# Altium schematic sheet Sheet1.SchDoc
size A4
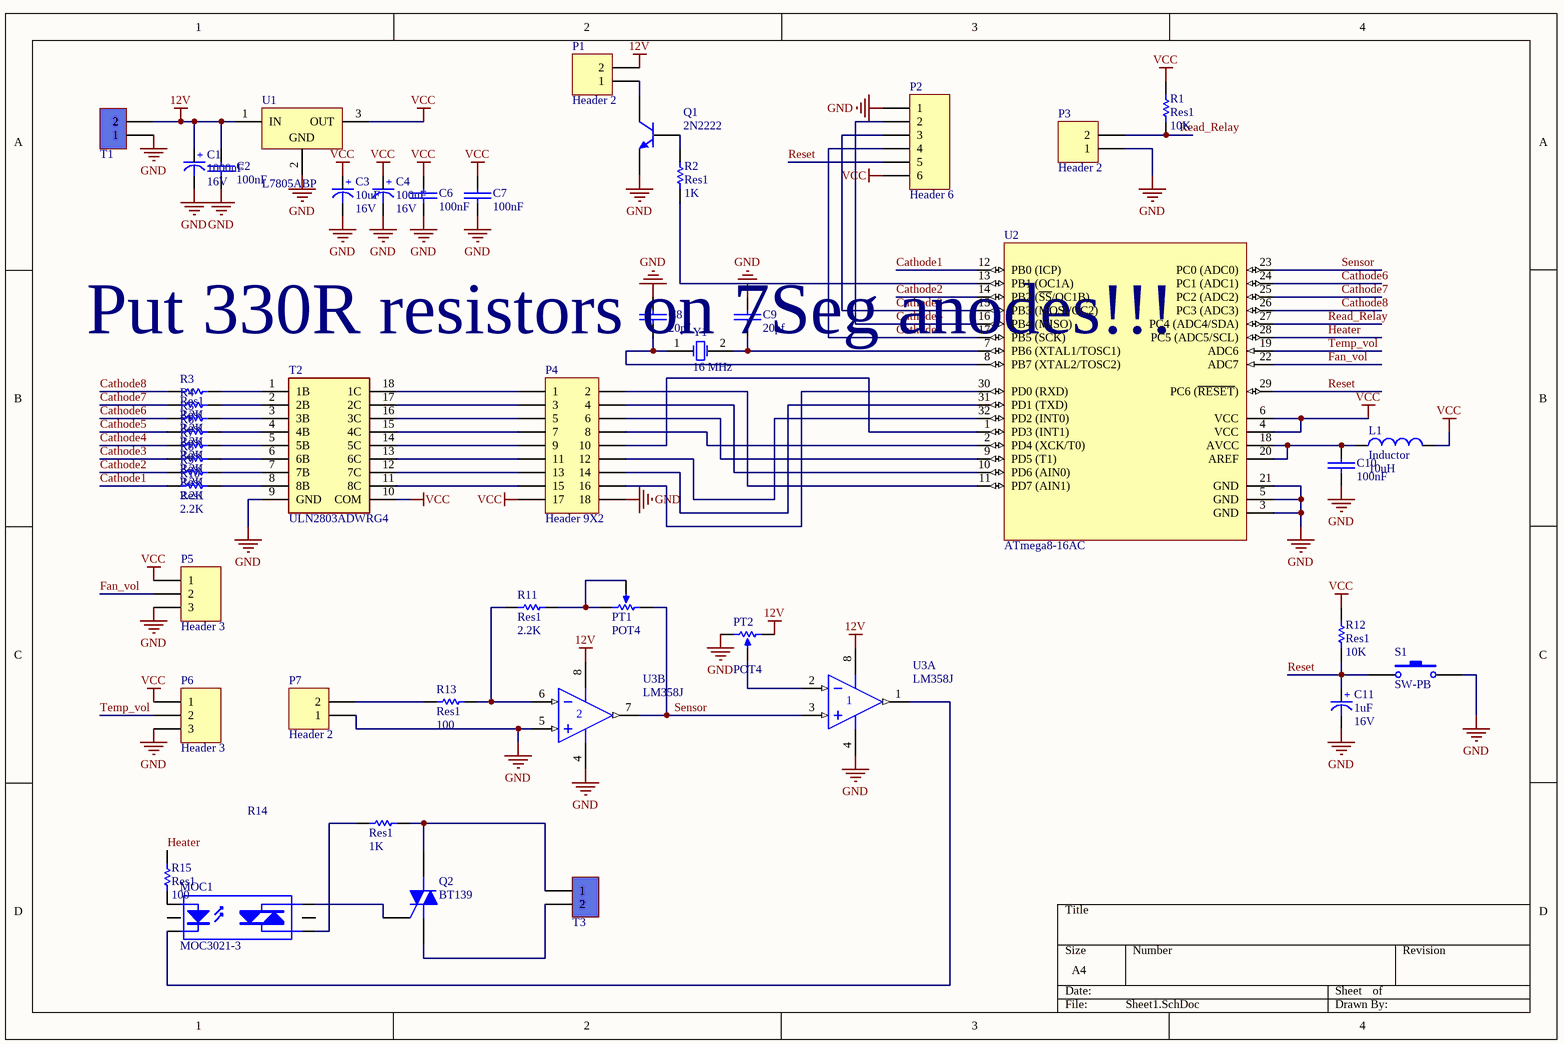
[diagram p0: Sheet1.SchDoc]

## Parts
C1  Voltage: 16V  [cap 04]  (hidden comment: 1000uF)
C2  100nF  [Cap - 100nF]
C3  Voltage: 16V  [cap 02]  (hidden comment: 10uF)
C4  Voltage: 16V  [cap 03]  (hidden comment: 100uF)
C6  100nF  [CAP 1206 (3216X15L)]
C7  100nF  [CAP 1206 (3216X15L)]
C8  20pf  [CAP 1206 (3216X15L)]
C9  20pf  [CAP 1206 (3216X15L)]
C10  100nF  [CAP 1206 (3216X15L)]
C11  Voltage: 16V  [cap 00]  (hidden comment: 1uF)
L1  Inductor  value 10uH  [AXIAL-0.4]
MOC1  MOC3021-3  [DIP-6]
P1  Header 2  [HDR1X2]
P2  Header 6  [HDR1X6]
P3  Header 2  [HDR1X2]
P4  Header 9X2  [HDR2X9]
P5  Header 3  [HDR1X3]
P6  Header 3  [HDR1X3]
P7  Header 2  [HDR1X2]
PT1  POT4  [POT4]
PT2  POT4  [POT4]
Q1  2N2222  [T4-TO92]
Q2  BT139  [TO-220-AB]
R1  Res1  value 10K  [AXIAL-0.3]
R2  Res1  value 1K  [AXIAL-0.3]
R3  Res1  value 2.2K  [AXIAL-0.3]
R4  Res1  value 2.2K  [AXIAL-0.3]
R5  Res1  value 2.2K  [AXIAL-0.3]
R6  Res1  value 2.2K  [AXIAL-0.3]
R7  Res1  value 2.2K  [AXIAL-0.3]
R8  Res1  value 2.2K  [AXIAL-0.3]
R9  Res1  value 2.2K  [AXIAL-0.3]
R10  Res1  value 2.2K  [AXIAL-0.3]
R11  Res1  value 2.2K  [AXIAL-0.3]
R12  Res1  value 10K  [AXIAL-0.3]
R13  Res1  value 100  [AXIAL-0.3]
R14  Res1  value 1K  [AXIAL-0.3]
R15  Res1  value 100  [AXIAL-0.3]
S1  SW-PB  [SPST-2]
T1  Terminal  [Terminal 1*2]  (value not drawn)
T2  ULN2803ADWRG4  [SOIC127P1030X265-18N]
T3  Terminal  [Terminal 1*2]  (value not drawn)
U1  L7805ABP  [TO220FP]
U2  ATmega8-16AC  [32A_M]
U3  LM358J  [693-02]  (parts A,B of 2)
Y1  16 MHz  [XTAL]

## Nets
12V: C1.1(+) C2.1(+) P1.2 PT2.2(BOT) T1.2 U1.1(IN) U3.8(V+)
GND: C1.2(-) C2.2(-) C3.2(-) C4.2(-) C6.2(-) C7.2(-) C8.2(-) C9.1(+) C10.2(-) C11.2(-) P2.1 P3.1 P4.18 P5.3 P6.3 P7.1 PT2.1(TOP) Q1.E S1.2 T1.1 T2.9(GND) U1.2(GND) U2.3(GND) U2.5(GND) U2.21(GND) U3.4(V-) U3.5(IN+)
VCC: C3.1(+) C4.1(+) C6.1(+) C7.1(+) L1.2 P2.6 P4.17 P5.1 P6.1 R1.1 R12.1 T2.10(COM) U1.3(OUT) U2.4(VCC) U2.6(VCC)
Cathode1: R10.1 U2.12(PB0_(ICP))
Cathode2: R9.1 U2.14(PB2_(~{SS}/OC1B))
Cathode3: P2.3 R8.1 U2.15(PB3_(MOSI/OC2))
Cathode4: P2.2 R7.1 U2.16(PB4_(MISO))
Cathode5: P2.4 R6.1 U2.17(PB5_(SCK))
Cathode6: R5.1 U2.24(PC1_(ADC1))
Cathode7: R4.1 U2.25(PC2_(ADC2))
Cathode8: R3.1 U2.26(PC3_(ADC3))
Fan_vol: P5.2 U2.22(ADC7)
Heater: R15.1 U2.28(PC5_(ADC5/SCL))
Read_Relay: P3.2 R1.2 U2.27(PC4_(ADC4/SDA))
Reset: C11.1(+) P2.5 R12.2 S1.1 U2.29(PC6_(~{RESET}))
Sensor: PT1.1(TOP) U2.23(PC0_(ADC0)) U3.3(IN+) U3.7(OUT)
Temp_vol: P6.2 U2.19(ADC6)
NetC8_1: C8.1(+) U2.8(PB7_(XTAL2/TOSC2)) Y1.1(OSC1)
NetC9_2: C9.2(-) U2.7(PB6_(XTAL1/TOSC1)) Y1.2(OSC2)
NetC10_1: C10.1(+) L1.1 U2.18(AVCC) U2.20(AREF)
NetMOC1_1: MOC1.1(A) R15.2
NetMOC1_2: MOC1.2(K) U3.1(OUT)
NetMOC1_4: MOC1.4(A/K) Q2.3(G)
NetMOC1_6: MOC1.6(A/K) R14.1
NetP1_1: P1.1 Q1.C
NetP4_1: P4.1 T2.18(1C)
NetP4_2: P4.2 U2.11(PD7_(AIN1))
NetP4_3: P4.3 T2.17(2C)
NetP4_4: P4.4 U2.10(PD6_(AIN0))
NetP4_5: P4.5 T2.16(3C)
NetP4_6: P4.6 U2.9(PD5_(T1))
NetP4_7: P4.7 T2.15(4C)
NetP4_8: P4.8 U2.2(PD4_(XCK/T0))
NetP4_9: P4.9 T2.14(5C)
NetP4_10: P4.10 U2.1(PD3_(INT1))
NetP4_11: P4.11 T2.13(6C)
NetP4_12: P4.12 U2.32(PD2_(INT0))
NetP4_13: P4.13 T2.12(7C)
NetP4_14: P4.14 U2.31(PD1_(TXD))
NetP4_15: P4.15 T2.11(8C)
NetP4_16: P4.16 U2.30(PD0_(RXD))
NetP7_2: P7.2 R13.1
NetPT1_2: PT1.2(BOT) PT1.3(TAP) R11.2
NetPT2_3: PT2.3(TAP) U3.2(IN-)
NetQ1_B: Q1.B R2.1
NetQ2_1: Q2.1(M1) T3.2
NetQ2_2: Q2.2(M2) R14.2 T3.1
NetR2_2: R2.2 U2.13(PB1_(OC1A))
NetR3_2: R3.2 T2.1(1B)
NetR4_2: R4.2 T2.2(2B)
NetR5_2: R5.2 T2.3(3B)
NetR6_2: R6.2 T2.4(4B)
NetR7_2: R7.2 T2.5(5B)
NetR8_2: R8.2 T2.6(6B)
NetR9_2: R9.2 T2.7(7B)
NetR10_2: R10.2 T2.8(8B)
NetR11_1: R11.1 R13.2 U3.6(IN-)

Not connected (* = marked no-connect by the designer): MOC1 3(NC) 5(NC)

## Notes on the sheet
- Put 330R resistors on 7Seg anodes!!!

## Library data of the parts
C1 C3 C4 C11 = Cap-Polar: Polar Capacitor; Designer: Saeid Jorablo; Organazation: ControTec; Adding Date: 1387/12/20
  C1: Value: 1000uF
  C3: Value: 10uF
  C4: Value: 100uF
  C11: Value: 1uF
C2 C6-C10 = Cap-Bipolar: Bipolar Capacitor; Voltage: 100V; Designer: Saeid Jorablo; Organazation: ControTec; Adding Date: 1387/12/20
  C2 C6 C7 C10: Value: 100nF
  C8 C9: Value: 20pf
L1 = Inductor: Code_IEC: 1005; Published: 8-Jun-2000; LatestRevisionDate: 29-May-2009; LatestRevisionNote: IPC-7351 Footprint Added.; PackageReference: 0402-A; Publisher: Altium Limited; PackageDescription: Chip Inductor; Code_JEITA: 0402
MOC1 = MOC3021-3: Opto-Triac; Designer: Seyed Mohsen Ghasemian; E-mail: picpars@gmail.com; Published: 17-11-2011; LatestRevisionDate: 17-11-2011; Publisher: www.picpars.com; WEB: www.picpars.com
P1 P3 P7 = Header 2: Header, 2-Pin; LatestRevisionDate: 17-Jul-2002; LatestRevisionNote: Re-released for DXP Platform.; Publisher: Altium Limited
P2 = Header 6: Header, 6-Pin; LatestRevisionDate: 17-Jul-2002; LatestRevisionNote: Re-released for DXP Platform.; Publisher: Altium Limited
P4 = Header 9X2: Header, 9-Pin, Dual row; LatestRevisionDate: 17-Jul-2002; LatestRevisionNote: Re-released for DXP Platform.; Publisher: Altium Limited
P5 P6 = Header 3: Header, 3-Pin; LatestRevisionDate: 17-Jul-2002; LatestRevisionNote: Re-released for DXP Platform.; Publisher: Altium Limited
PT1 PT2 = POT4: Variable Potentiometer top adjust; Designer: Seyed Mohsen Ghasemian; WEB: www.picpars.com
Q1 = 2N2222: NPN; E-mail: picpars@gmail.com; De: Seyed Mohsen Ghasemian; web: www.picpars.com
Q2 = MAC15A6: Silicon Bidirectional Triode Thyristor; Note: Pin 2 is electrically connected to Pin 4 (TAB); Published: 29-Sep-2000; LatestRevisionDate: 17-Jul-2002; LatestRevisionNote: Re-released for DXP Platform.; DatasheetVersion: 1999; PackageVersion: 1997; PackageReference: 221A-09; Publisher: Altium Limited; PackageDescription: TO, Thru-Hole, Vertical, Heatsink Mounted; 3 In-Line Leads; Pitch 2.54 mm; Code_JEDEC: TO-262-AA; ComponentLink1Description: Manufacturer Link; ComponentLink1URL: http://www.onsemi.com/site/products/landing?taxonomyID=194; ComponentLink2Description: Datasheet; ComponentLink2URL: http://www.onsemi.com/pub/Collateral/MAC15A4-D.PDF
R1-R15 = Res1: Resistor; Published: 8-Jun-2000; LatestRevisionDate: 17-Jul-2002; LatestRevisionNote: Re-released for DXP Platform.; PackageReference: AXIAL-0.3; Publisher: Altium Limited; PackageDescription: Axial Device, Thru-Hole; 2 Leads; 0.3 in Pin Spacing
S1 = SW-PB: Switch; Published: 24-Mar-1999; LatestRevisionDate: 17-Jul-2002; LatestRevisionNote: Re-released for DXP Platform.; PackageReference: SPST-2; Publisher: Altium Limited; PackageDescription: Switch; 2 Leads
T1 T3 = Terminal 1*2: Terminal 2 Pin 250VAC 16A; Designer: Seyed Mohsen Ghasemain; E-mail: picpars@gmail.com; ComponentLinkURL: www.picpars.com
T2 = ULN2803ADWRG4: Transformer; Manufacturer_Name: Texas Instruments; Datasheet Link: http://www.ti.com/lit/ds/symlink/uln2803a.pdf; Height: 2.65mm; Manufacturer_Part_Number: ULN2803ADWRG4; Mouser Part Number: 595-ULN2803ADWRG4; Mouser Price/Stock: https://www.mouser.com/Search/Refine.aspx?Keyword=595-ULN2803ADWRG4
U1 = L7805ABP: Positive Voltage Regulator, 5V, 3-Pin TO-220FP; DatasheetVersion: Nov-2011; PackageVersion: 2011; PackageReference: TO220FP; PackageDescription: TO, Thru-Hole, Vertical, Heatsink Mounted; 3 In-Line Leads; Pitch 2.54 mm; PartNumber: L7805ABP; ComponentLink1Description: Manufacturer URL; ComponentLink1URL: http://www.st.com; ComponentLink2Description: Datasheet; ComponentLink2URL: http://www.st.com/internet/com/TECHNICAL_RESOURCES/TECHNICAL_LITERATURE/DATASHEET/CD00000444.pdf
U2 = ATmega8-16AC: 8-Bit AVR Microcontroller with 8K Bytes of In-System Programmable Flash Memory; Published: 17-Sep-2003; LatestRevisionDate: 13-Apr-2006; LatestRevisionNote: IPC-7351 Footprint Added.; DatasheetVersion: 2486H-AVR-09/02; PackageVersion: revB, Oct-2001; PackageReference: 32A; Publisher: Altium Limited; PackageDescription: 32-Pin Thin Quad Flat Pack 0.8 mm Pitch; Code_JEDEC: MS-026-ABA; ComponentLink1Description: Manufacturer Link; ComponentLink1URL: http://www.atmel.com; ComponentLink2Description: Datasheet; ComponentLink2URL: http://www.atmel.com/dyn/resources/prod_documents/doc2486.pdf
U3 = LM358J: Dual Low-Power Operational Amplifier; Published: 17-Jul-2002; LatestRevisionDate: 06-Jun-2005; LatestRevisionNote: Stylized 3D Model Added.; DatasheetVersion: 1988; PackageReference: 693-02; Publisher: Altium Limited; PackageDescription: DIP; 8 Leads; Row Spacing 7.62 mm; Pitch 2.54 mm; Code_JEDEC: MO-001-AN; ComponentLink1Description: Manufacturer Link; ComponentLink1URL: http://www.onsemi.com/site/products/parametrics/0,4446,251,00.html; ComponentLink2Description: Datasheet; ComponentLink2URL: http://www.onsemi.com/pub/Collateral/LM358-D.PDF
Y1 = XTAL: XTAL Crystal; Company: E.P.I.L; Design Date: 11/04/2011; Value: 16 MHz